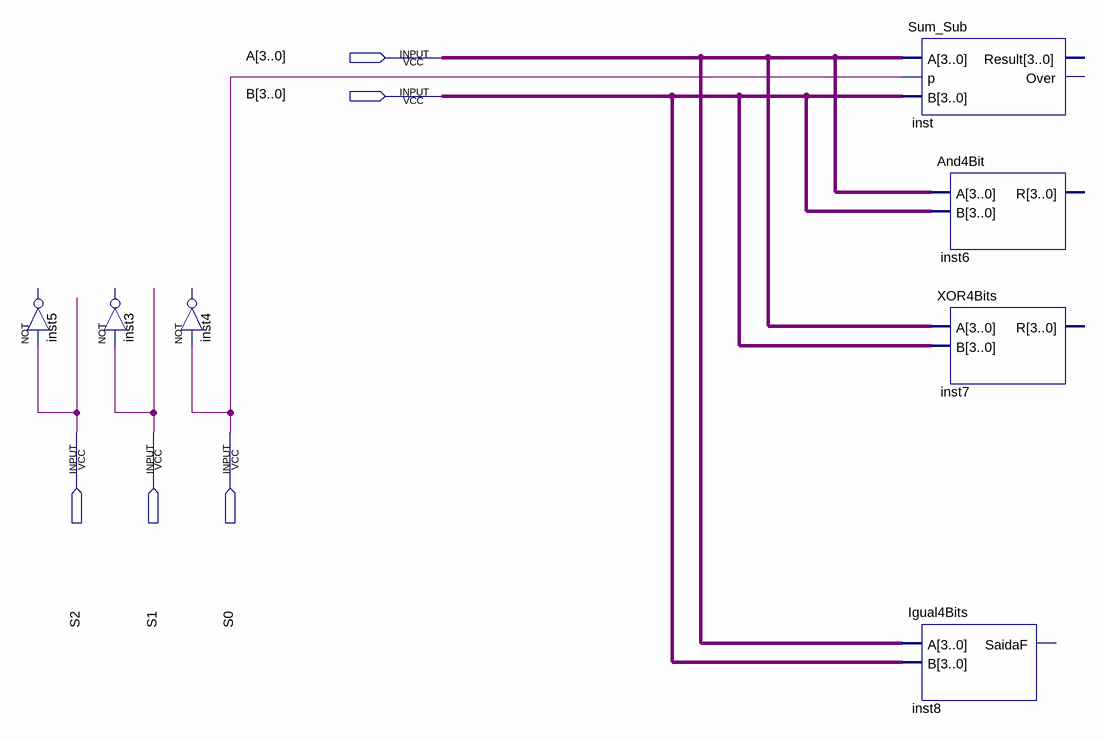
[diagram p0: schematic sheet]
// Quartus schematic Block3.bdf as structural Verilog: 7 symbols, 5 pins
module Block3 (
  input  [3:0] A,
  input  [3:0] B,
  input  S2,
  input  S1,
  input  S0
);

  // NOT inst5 has open pins: IN=S2, OUT=open
  // NOT inst3 has open pins: IN=S1, OUT=open
  // NOT inst4 has open pins: IN=S0, OUT=open
  Sum_Sub inst (.A(A), .p(S0), .B(B));  // open: Result, Over
  Igual4Bits inst8 (.A(A), .B(B));  // open: SaidaF
  And4Bit inst6 (.A(A), .B(B));  // open: R
  XOR4Bits inst7 (.A(A), .B(B));  // open: R
endmodule
